# Altium schematic sheet 05_USART.SchDoc
size A4
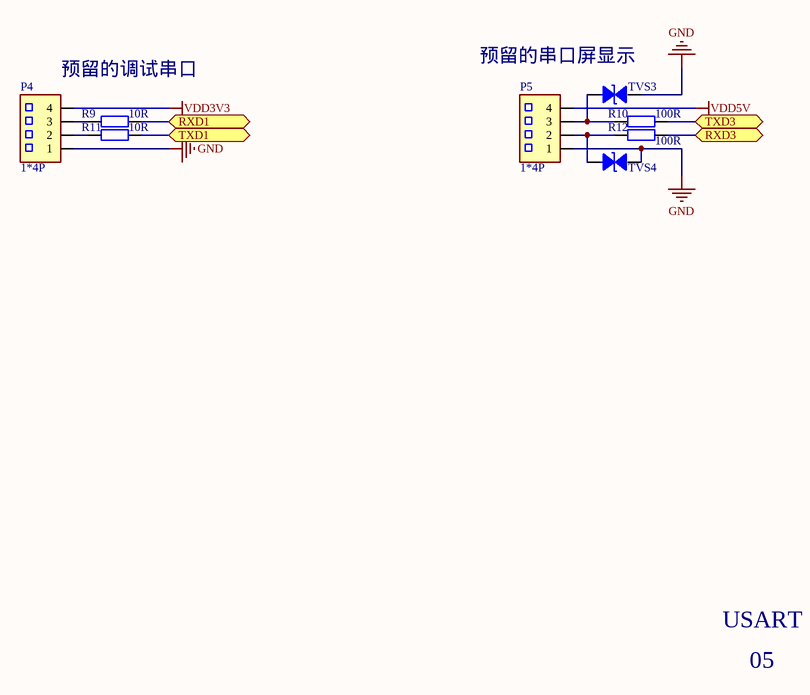
[diagram p0: 05_USART.SchDoc]

## Parts
P4  1*4P  [XH2.54-4A]
P5  1*4P  [XH2.54-4A]
R9  10R  [SMD-0603]
R10  100R  [SMD-0603]
R11  10R  [SMD-0603]
R12  100R  [SMD-0603]
TVS3  ESD5Z5.0CT1G  [SOD-523]  (value not drawn)
TVS4  ESD5Z5.0CT1G  [SOD-523]  (value not drawn)

## Ports
RXD1 (bidir), RXD3 (bidir), TXD1 (bidir), TXD3 (bidir)

## Nets
GND: P4.1 P5.1 TVS3.1(A) TVS4.1(A)
VDD3V3: P4.4
VDD5V: P5.4
RXD1: R9.2 ; port RXD1
RXD3: R12.2 ; port RXD3
TXD1: R11.2 ; port TXD1
TXD3: R10.2 ; port TXD3
NetP4_2: P4.2 R11.1
NetP4_3: P4.3 R9.1
NetP5_2: P5.2 R12.1 TVS4.2(B)
NetP5_3: P5.3 R10.1 TVS3.2(B)

## Notes on the sheet
- 预留的调试串口
- 预留的串口屏显示
- USART
- 05

## Library data of the parts
P4 P5 = HDR1*4
R9-R12 = RES2: 贴片电阻 5%
TVS3 TVS4 = TVS-1: TVS